# EAGLE schematic ESP8266-DS18B20 (EAGLE 7.6.0)
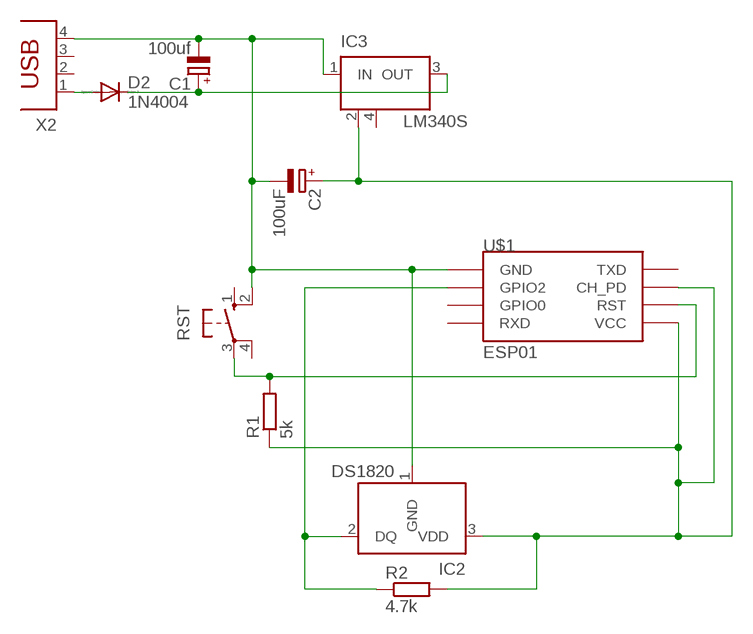
[diagram p0: schematic, sheet 1]

## Parts
C1  100uf  CPOL-EUE2.5-5  [E2,5-5]
C2  100uF  CPOL-EUE2.5-5  [E2,5-5]
D2  1N4004  [DO41-10]
IC2  DS1820  [TO-92]
IC3  LM340S  [SOT223]
R1  5k  R-EU_0207/12  [0207/12]
R2  4.7k  R-EU_0207/12  [0207/12]
RST  10-XX  [B3F-10XX]
U$1  ESP01  [ESP01]
X2  PN61729  [PN61729]

## Nets
3V3: C2.+ IC2.3(VDD) IC3.2(GND) R1.1 R2.2 U$1.CH_PD U$1.VCC
5V: C1.+ D2.A D2.C IC3.3(OUT) X2.1
DQ: IC2.2(DQ) R2.1 U$1.GPIO2
GND: C1.- C2.- IC2.1(GND) IC3.1(IN) RST.2(S1) U$1.GND X2.4
N$2: R1.2 RST.3(P) U$1.RST
Unconnected: RST.1(S) RST.4(P1) U$1.GPIO0 U$1.RX(RXD) U$1.TX(TXD) X2.2 X2.3

## Power pins joined to a net without a drawn wire
GND: IC3.4(GND)

## Library data of the parts
C1 C2 = rcl:CPOL-EU: POLARIZED CAPACITOR, European symbol
D2 = diode:1N4004: DIODE general purpose rectifier, 1 A
IC2 = DS1820:DS1820: DS1820 - 1-Wire Digital Thermometer
IC3 = linear:LM340S: 3-Terminal Positive Regulators Source: http://cache.national.com/ds/LM/LM340.pdf
R1 R2 = resistor:R-EU_: RESISTOR, European symbol
RST = switch-omron:10-XX: OMRON SWITCH; MPN: B3F-1000; OC_FARNELL: 176432; OC_NEWARK: 36M3542
U$1 = esp8266modules:ESP01: ESP8266 Wifi module 01
X2 = con-berg:PN61729: BERG USB connector; OC_FARNELL: unknown; OC_NEWARK: unknown